# Altium schematic sheet J5.SchDoc: J5
size OrCAD A; Revision: A; SheetNumber: 1; SheetTotal: 1
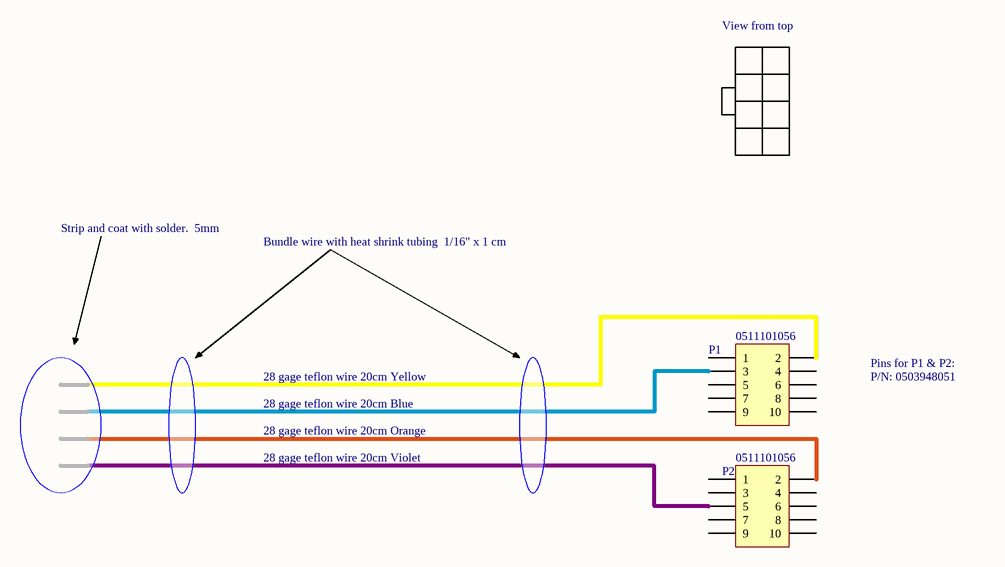
[diagram p0: J5.SchDoc]

## Parts
P1  Manufacturer Part Number: 0511101056  [HDR2X5]  (hidden comment: 10CKT 2MM MGRID WTB CONN CRIMP)
P2  Manufacturer Part Number: 0511101056  [HDR2X5]  (hidden comment: 10CKT 2MM MGRID WTB CONN CRIMP)

## Nets

Not connected (* = marked no-connect by the designer): P1 1 2 3 4 5 6 7 8 9 10; P2 1 2 3 4 5 6 7 8 9 10

## Notes on the sheet
- View from top
- Strip and coat with solder.  5mm
- Bundle wire with heat shrink tubing  1/16" x 1 cm
- 28 gage teflon wire 20cm Yellow
- Pins for P1 & P2:
- P/N: 0503948051
- 28 gage teflon wire 20cm Blue
- 28 gage teflon wire 20cm Orange
- 28 gage teflon wire 20cm Violet
- Title
- Size:
- Date:
- Orcad A
- Number:
- Time:
- Revision:
- Sheet
- of
- ZLS Corporation
- 7801 North Lamar Blvd.
- Suite E-184
- Austin, Texas 78752  USA
- (512) 453-0288
- File:

## Library data of the parts
P1 P2 = Header 5X2: Manufacturer: Molex, LLC; Connector Type: Receptacle; Number of Positions: 10; Pitch: 0.079" (2.00mm); Note: Contacts Not Included; Supplier 1: Digi-Key; Supplier Part Number 1: WM13240-ND; RoHS: RoHS Compliant; Description: 10CKT 2MM MGRID WTB CONN CRIMP; Category: Connectors, Interconnects; Stock 1: 5126; Pricing 1: 1=0.23, 10=0.217, 25=0.1852, 50=0.1622, 100=0.1505, 250=0.13316, 500=0.12738, 1000=0.10422, 2500=0.09554 (USD); Packaging: Bulk; Part Status: Active; Contact Type: Female Socket; Number of Rows: 2; Row Spacing: 0.079" (2.00mm); Mounting Type: Free Hanging (In-Line); Contact Termination: Crimp; Fastening Type: Locking Ramp; Color: Black; Features: -; ComponentLink1URL: http://www.molex.com/pdm_docs/sd/511101056_sd.pdf; ComponentLink1Description: http://www.molex.com/pdm_docs/sd/511101056_sd.pdf